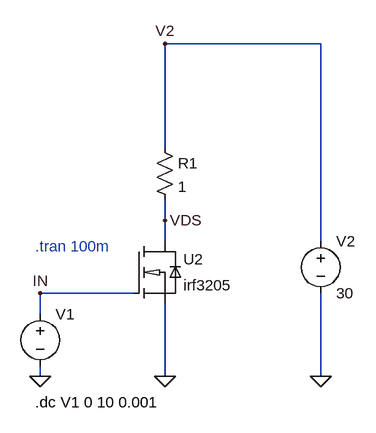
[diagram p0: schematic Test (If Spice works) IRF3205.asc]
Test (If Spice works) IRF3205.asc, the LTspice schematic file:
Version 4.1
SHEET 1 880 680
WIRE 80 -224 -160 -224
WIRE -160 -64 -160 -224
WIRE -160 48 -160 16
WIRE -160 80 -160 48
WIRE 80 80 80 -224
WIRE -208 160 -352 160
WIRE -352 192 -352 160
WIRE -352 288 -352 272
WIRE -160 288 -160 176
WIRE 80 288 80 160
FLAG -352 288 0
FLAG -160 288 0
FLAG 80 288 0
FLAG -352 160 IN
FLAG -160 48 VDS
FLAG -160 -224 V2
SYMBOL voltage -352 176 R0
WINDOW 3 -75 203 Left 2
WINDOW 123 0 0 Left 0
WINDOW 39 0 0 Left 0
SYMATTR Value ""
SYMATTR InstName V1
SYMBOL voltage 80 64 R0
WINDOW 123 0 0 Left 0
WINDOW 39 0 0 Left 0
SYMATTR InstName V2
SYMATTR Value 30
SYMBOL res -176 -80 R0
SYMATTR InstName R1
SYMATTR Value 1
SYMBOL ZmySymbol\\Transistors\\MOSFET\\IRF3205 -208 80 R0
SYMATTR InstName U2
TEXT -360 88 Left 2 ;.tran 100m
TEXT -360 328 Left 2 !.dc V1 0 10 0.001

The netlist it stands for:
* Test (If Spice works) IRF3205.asc
V1 IN 0
V2 V2 0 30
R1 V2 VDS 1
X§U2 VDS IN 0 irf3205  ; pins D G S
* .tran 100m
.dc V1 0 10 0.001
.lib IRF3205.lib
.backanno
.end